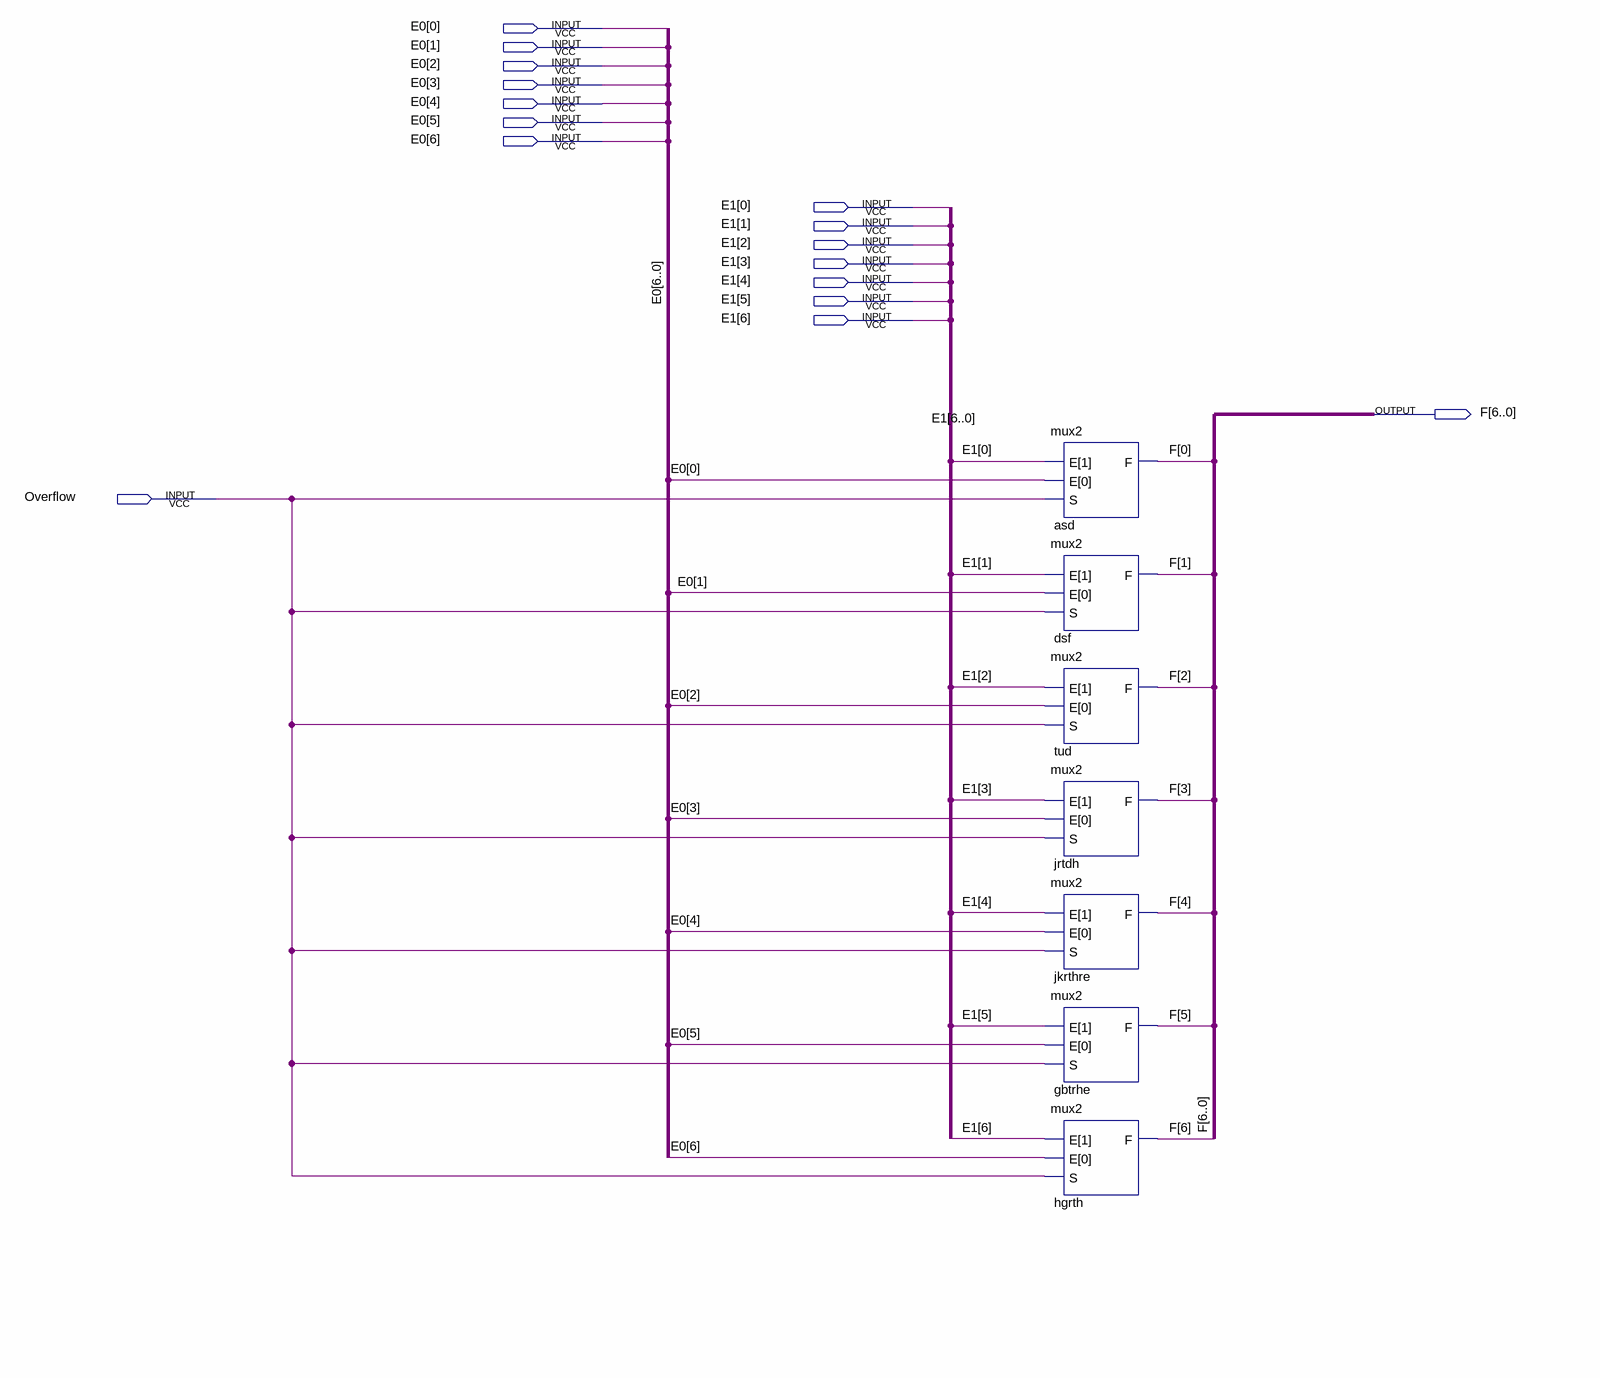
[diagram p0: schematic sheet]
// Quartus schematic mux2-decod.bdf as structural Verilog: 7 symbols, 16 pins
module \mux2-decod  (
  input  [6:0] E0,
  input  [6:0] E1,
  input  Overflow,
  output [6:0] F
);

  mux2 asd (.E({E1[0], E0[0]}), .S(Overflow), .F(F[0]));
  mux2 dsf (.E({E1[1], E0[1]}), .S(Overflow), .F(F[1]));
  mux2 tud (.E({E1[2], E0[2]}), .S(Overflow), .F(F[2]));
  mux2 jrtdh (.E({E1[3], E0[3]}), .S(Overflow), .F(F[3]));
  mux2 jkrthre (.E({E1[4], E0[4]}), .S(Overflow), .F(F[4]));
  mux2 gbtrhe (.E({E1[5], E0[5]}), .S(Overflow), .F(F[5]));
  mux2 hgrth (.E({E1[6], E0[6]}), .S(Overflow), .F(F[6]));
endmodule
